# EAGLE design untitled (EAGLE 9.5.1)
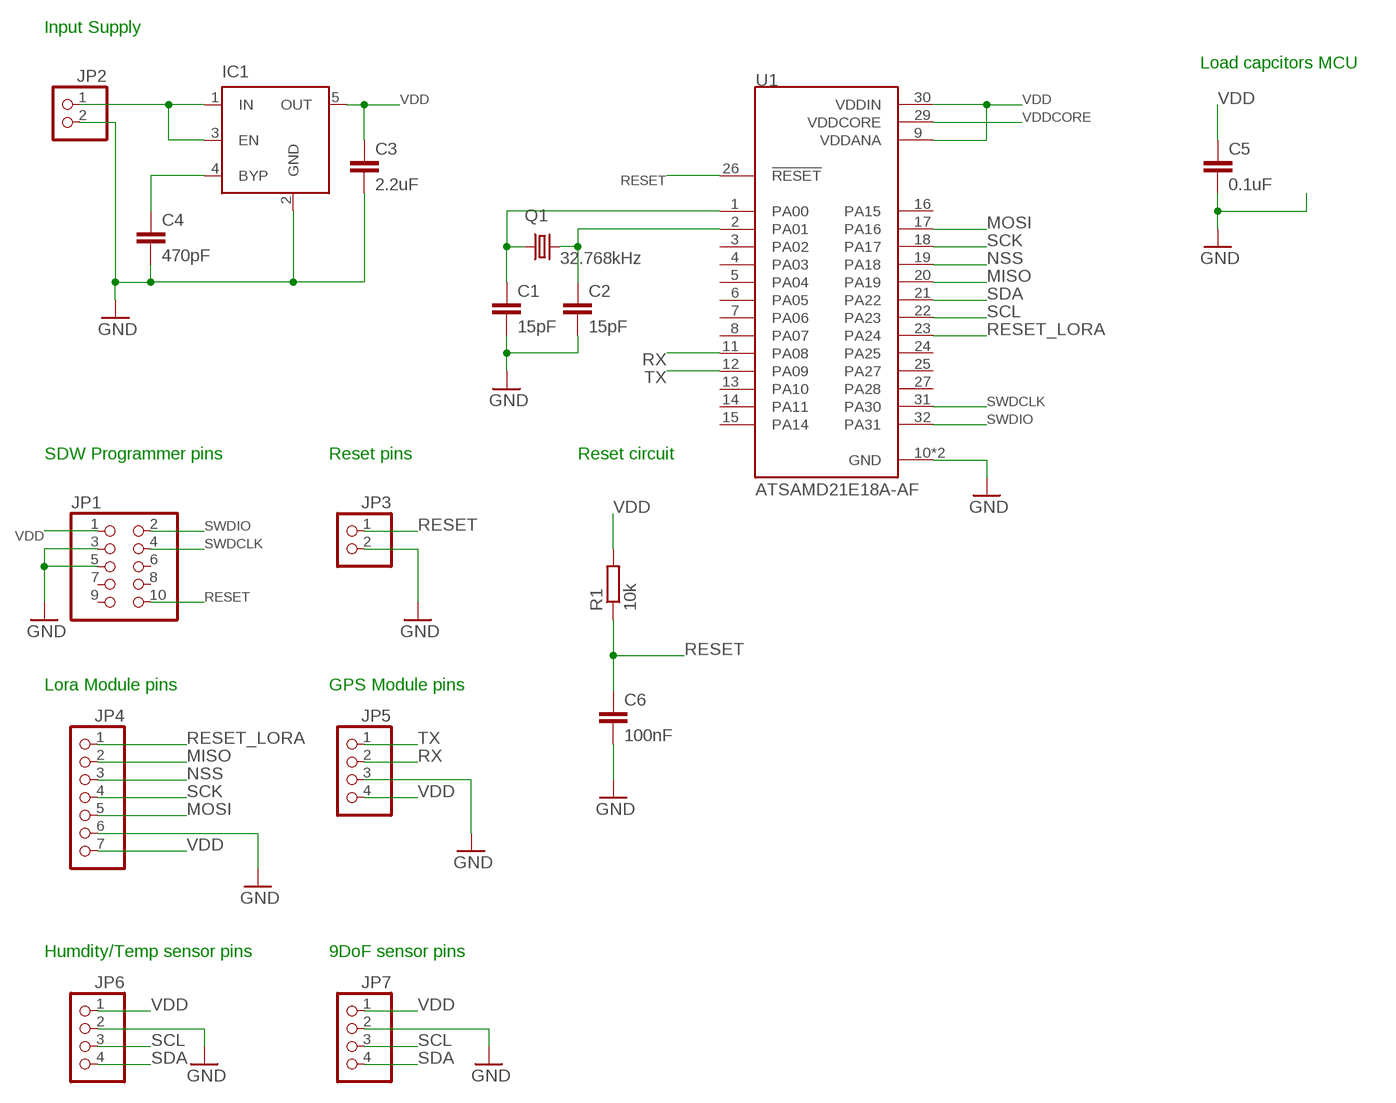
[diagram p0: schematic, sheet 1]

## Parts
C1  15pF  C-EUC0805  [C0805]
C2  15pF  C-EUC0805  [C0805]
C3  2.2uF  C-EUC0805  [C0805]
C4  470pF  C-EUC0805  [C0805]
C5  0.1uF  C-EUC0805  [C0805]
C6  100nF  C-EUC0805  [C0805]
IC1  MIC5219XX  [SOT23-5]
JP1  PINHD-2X5  [2X05]
JP2  PINHD-1X2  [1X02]
JP3  PINHD-1X2  [1X02]
JP4  PINHD-1X7  [1X07]
JP5  PINHD-1X4  [1X04]
JP6  PINHD-1X4  [1X04]
JP7  PINHD-1X4  [1X04]
Q1  32.768kHz  CRYSTALCTS406  [CTS406]
R1  10k  R-EU_R0805  [R0805]
U1  ATSAMD21E18A-AF  [QFP80P900X900X120-32N]

## Nets
BYP: C4.1 IC1.4(BYP)
GND: C1.2 C2.2 C3.2 C4.2 C5.2 C6.2 IC1.2(GND) JP1.3 JP1.5 JP2.2 JP3.2 JP4.6 JP5.3 JP6.2 JP7.2 U1.10(GND) U1.28(GND)
INPUT: IC1.1(IN) IC1.3(EN) JP2.1
MISO: JP4.2 U1.20(PA19)
MOSI: JP4.5 U1.17(PA16)
N$1: C1.1 Q1.1 U1.1(PA00)
N$2: C2.1 Q1.3 U1.2(PA01)
NSS: JP4.3 U1.19(PA18)
RESET: C6.1 JP1.10 JP3.1 R1.1 U1.26(!RESET)
RESET_LORA: JP4.1 U1.23(PA24)
RX: JP5.2 U1.11(PA08)
SCK: JP4.4 U1.18(PA17)
SCL: JP6.3 JP7.3 U1.22(PA23)
SDA: JP6.4 JP7.4 U1.21(PA22)
SWDCLK: JP1.4 U1.31(PA30)
SWDIO: JP1.2 U1.32(PA31)
TX: JP5.1 U1.12(PA09)
VDD: C3.1 C5.1 IC1.5(OUT) JP1.1 JP4.7 JP5.4 JP6.1 JP7.1 R1.2 U1.9(VDDANA) U1.30(VDDIN)
VDDCORE: U1.29(VDDCORE)
Unconnected: JP1.6 JP1.7 JP1.8 JP1.9 U1.3(PA02) U1.4(PA03) U1.5(PA04) U1.6(PA05) U1.7(PA06) U1.8(PA07) U1.13(PA10) U1.14(PA11) U1.15(PA14) U1.16(PA15) U1.24(PA25) U1.25(PA27) U1.27(PA28)

## Notes on the sheet
- Input Supply
- Load capcitors MCU
- SDW Programmer pins | Reset pins | Reset circuit
- Lora Module pins | GPS Module pins
- Humdity/Temp sensor pins | 9DoF sensor pins

## Library data of the parts
C1-C6 = rcl:C-EU: CAPACITOR, European symbol; SPICEPREFIX: C
IC1 = v-reg-micrel:MIC5219XX: VOLTAGE REGULATOR; OC_FARNELL: unknown; OC_NEWARK: unknown
JP1 = pinhead:PINHD-2X5: PIN HEADER
JP2 JP3 = pinhead:PINHD-1X2: PIN HEADER
JP4 = pinhead:PINHD-1X7: PIN HEADER
JP5-JP7 = pinhead:PINHD-1X4: PIN HEADER
Q1 = crystal:CRYSTAL: CRYSTAL; OC_FARNELL: unknown; OC_NEWARK: unknown
R1 = rcl:R-EU_: RESISTOR, European symbol; SPICEPREFIX: R
U1 = ATSAMD21E18A-AF:ATSAMD21E18A-AF: The SAM D21 is a series of low-power microcontrollers using the 32-bit ARM® Cortex® -M0+ processor, and ranging from 32- to 64-pins with up to 256KB Flash and 32KB of SRAM. The SAM D21 operate at a maximum frequency of 48MHz and reach 2.46 CoreMark® /MHz.; AVAILABILITY: Unavailable; DESCRIPTION: MCU 32-Bit SAM D21E ARM Cortex M0+ RISC 256KB Flash 3.3V 32-Pin TQFP Tray; MF: Microchip; MP: ATSAMD21E18A-AF; PACKAGE: TQFP-32 Microchip; PRICE: None

## Board
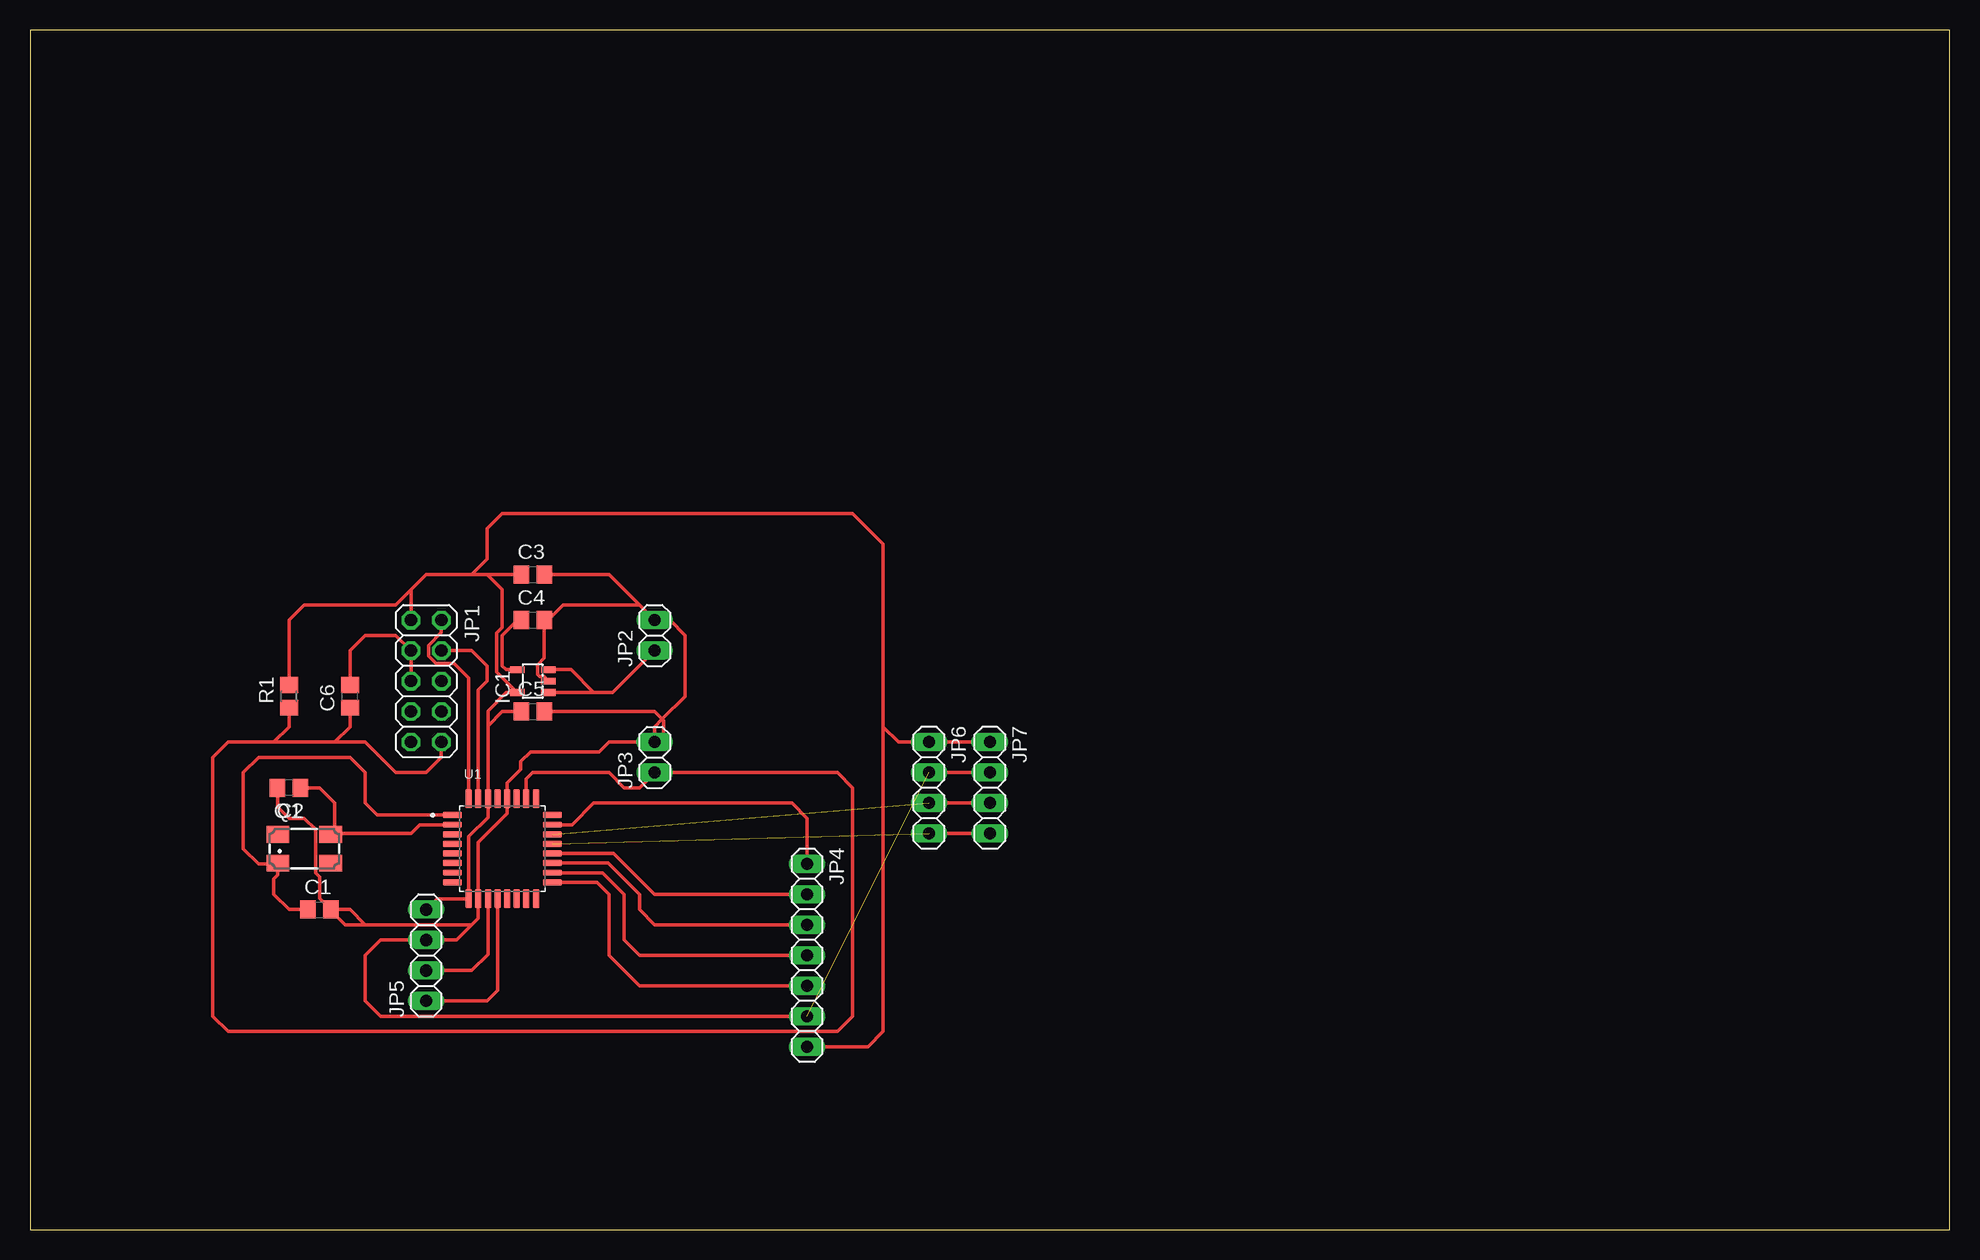
[diagram p1: board, top side]
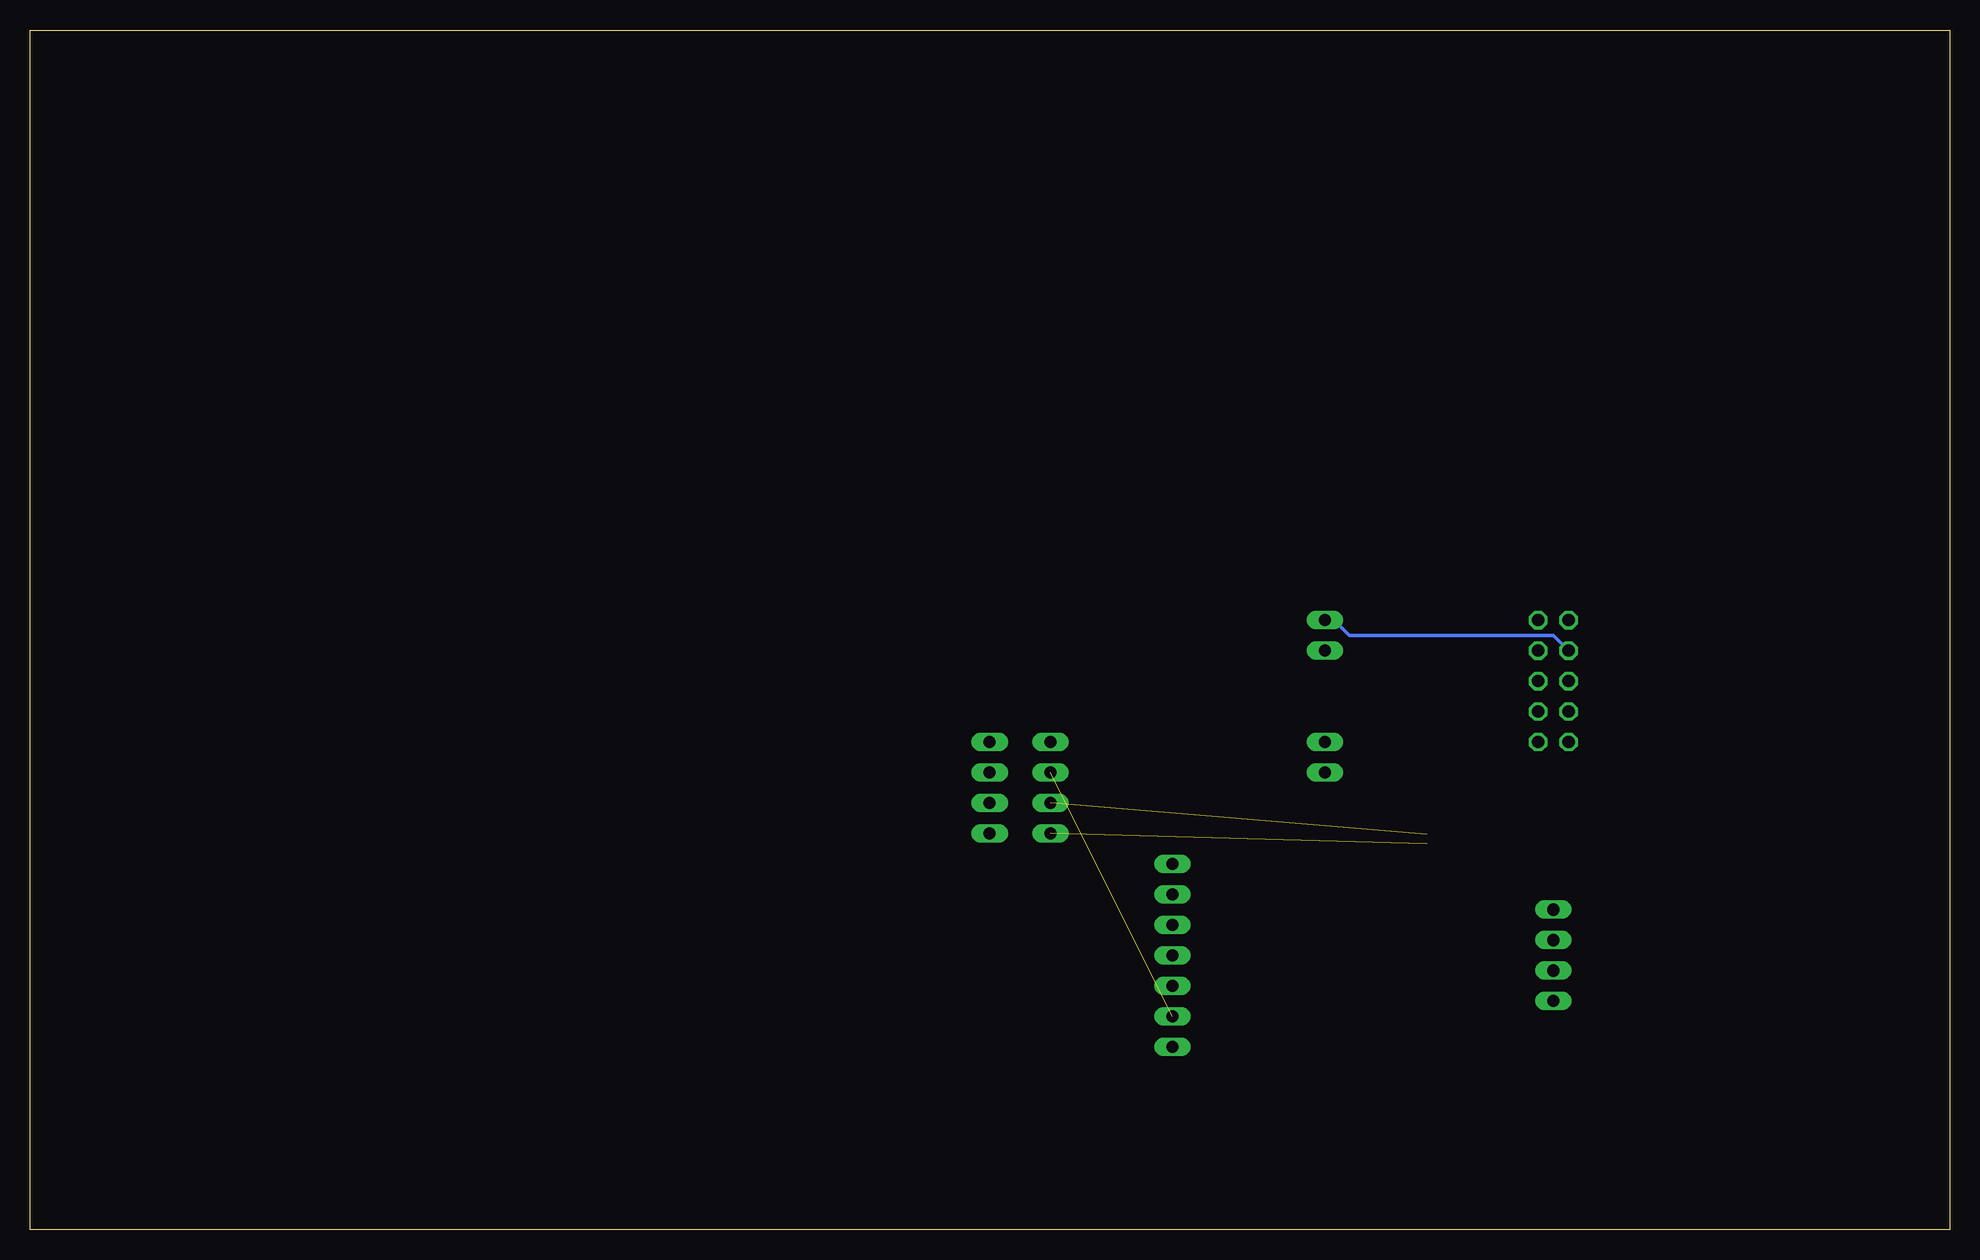
[diagram p2: board, bottom side, seen from below]

Size 160 x 100 mm. Coordinates in mm from the lower left corner, seen from the top.
Outline: 0,0 160,0 160,100 0,100 0,0
Copper layers (1*16): Top 0.035mm / dielectric 1.5mm / Bottom 0.035mm
Design rules "default": minimum track width 6mil, minimum drill 0.35mm, track to track 6mil, track to pad 6mil, pad to pad 6mil, via to via 6mil, smd to smd 6mil, copper to edge 40mil, drill to drill 6mil, minimum pad ring 10mil, minimum via ring 8mil, stop-mask expansion 4mil, vias tented up to drill 0mil, thermal gap 10mil

### Footprints (pad centres in the part's own frame; a part is rotated, then mirrored left to right if it is on the bottom)
C0805 = smd 1.3 x 1.5: 1 -0.95,0; 2 0.95,0
SOT23-5 = smd 0.55 x 1.2: 1 -0.95,-1.3; 2 0,-1.3; 3 0.95,-1.3; 4 0.95,1.3; 5 -0.95,1.3
2X05 = drill 1.016 octagon: 1 -5.08,-1.27; 2 -5.08,1.27; 3 -2.54,-1.27; 4 -2.54,1.27; 5 0,-1.27; 6 0,1.27; 7 2.54,-1.27; 8 2.54,1.27; 9 5.08,-1.27; 10 5.08,1.27
1X02 = drill 1.016 long: 1 -1.27,0; 2 1.27,0
1X07 = drill 1.016 long: 1 -7.62,0; 2 -5.08,0; 3 -2.54,0; 4 0,0; 5 2.54,0; 6 5.08,0; 7 7.62,0
1X04 = drill 1.016 long: 1 -3.81,0; 2 -1.27,0; 3 1.27,0; 4 3.81,0
CTS406 = smd 1.9 x 1.4: 1 -2.2,-1.2; 2 2.2,-1.2; 3 2.2,1.2; 4 -2.2,1.2
R0805 = smd 1.3 x 1.5: 1 -0.95,0; 2 0.95,0
QFP80P900X900X120-32N = smd 1.6 x 0.55: 1 -4.18,2.8; 2 -4.18,2; 3 -4.18,1.2; 4 -4.18,0.4; 5 -4.18,-0.4; 6 -4.18,-1.2; 7 -4.18,-2; 8 -4.18,-2.8; 17 4.18,-2.8; 18 4.18,-2; 19 4.18,-1.2; 20 4.18,-0.4; 21 4.18,0.4; 22 4.18,1.2; 23 4.18,2; 24 4.18,2.8 | smd 0.55 x 1.6: 9 -2.8,-4.18; 10 -2,-4.18; 11 -1.2,-4.18; 12 -0.4,-4.18; 13 0.4,-4.18; 14 1.2,-4.18; 15 2,-4.18; 16 2.8,-4.18; 25 2.8,4.18; 26 2,4.18; 27 1.2,4.18; 28 0.4,4.18; 29 -0.4,4.18; 30 -1.2,4.18; 31 -2,4.18; 32 -2.8,4.18

### Placement (x,y rotation side)
C1  24.13,26.67 0 top
C2  21.59,36.83 180 top
C3  41.91,54.61 0 top
C4  41.91,50.8 0 top
C5  41.91,43.18 0 top
C6  26.67,44.45 90 top
IC1  41.91,45.72 90 top
JP1  33.02,45.72 270 top
JP2  52.07,49.53 90 top
JP3  52.07,39.37 90 top
JP4  64.77,22.86 270 top
JP5  33.02,22.86 90 top
JP6  74.93,36.83 270 top
JP7  80.01,36.83 270 top
Q1  22.86,31.75 0 top
R1  21.59,44.45 90 top
U1  39.37,31.75 0 top

### Tracks (layer width: path | path; a pad name or v marks a point on that pad's centre or on a via)
BYP
  Top 0.305: IC1.4 39.69,46.67 39.37,46.99 39.37,49.53 40.64,50.8 C4.1
GND  (1 unrouted)
  Top 0.305: C2.2 20.64,35.24 21.59,34.29 22.86,34.29 23.8,33.34 23.8,29.72 24.13,29.4 24.13,27.62 C1.2 | 36.83,25.4 37.37,25.94 U1.10 37.37,32.29 39.77,34.69 U1.28 39.77,37.23 40.91,38.37 40.91,39.02 41.72,39.83 47.45,39.83 48.26,40.64 JP3.2 | 36.83,25.4 27.94,25.4 | 27.94,25.4 26.67,26.67 C1.2 | IC1.2 42.84,46.09 42.48,46.09 42.3,46.27 42.3,47.07 42.86,47.63 C4.2 43.18,50.8 44.45,52.07 50.8,52.07 | 50.8,52.07 JP2.2 53.34,50.8 54.61,49.53 54.61,44.45 52.7,42.55 | C3.2 48.26,54.61 50.8,52.07 | JP3.2 52.07,41.91 52.7,42.55 | 36.83,25.4 35.56,24.13 JP5.3 29.21,24.13 27.94,22.86 27.94,19.05 29.21,17.78 JP4.6 | C5.2 52.07,43.18 52.7,42.55 | JP1.5 JP1.3 30.48,49.53 27.94,49.53 26.67,48.26 C6.2 | 52.7,42.55 52.83,42.42 52.83,40.64 JP3.2 | 27.94,25.4 26.25,25.4 25.08,26.57 C1.2 | JP7.2 JP6.2
  Bottom 0.305: JP1.3 33.02,49.53 50.04,49.53 51.31,50.8 JP2.2
INPUT
  Top 0.305: IC1.1 46.99,44.77 | 46.99,44.77 48.58,44.77 JP2.1 | IC1.3 45.09,46.67 46.99,44.77
MISO
  Top 0.305: U1.20 48.66,31.35 52.07,27.94 JP4.2
MOSI
  Top 0.305: U1.17 47.25,28.95 48.26,27.94 48.26,22.86 50.8,20.32 JP4.5
N$1
  Top 0.305: C1.1 21.59,26.67 20.32,27.94 20.32,29.21 20.66,29.55 Q1.1 | 20.32,30.21 Q1.1 | U1.1 28.95,34.55 27.94,35.56 27.94,38.1 26.67,39.37 19.05,39.37 17.78,38.1 17.78,31.75 19.05,30.48 20.59,30.48 Q1.1
N$2
  Top 0.305: C2.1 24.13,36.83 25.4,35.56 25.4,33.29 Q1.3 25.13,33.02 31.75,33.02 32.48,33.75 U1.2
NSS
  Top 0.305: U1.19 48.19,30.55 50.8,27.94 50.8,26.67 52.07,25.4 JP4.3
RESET
  Top 0.305: 20.32,40.64 16.51,40.64 15.24,39.37 15.24,17.78 16.51,16.51 67.31,16.51 68.58,17.78 68.58,36.83 67.31,38.1 JP3.1 50.8,36.83 49.53,36.83 48.26,38.1 41.91,38.1 41.37,37.56 U1.26 | 20.32,40.64 25.4,40.64 | 25.4,40.64 27.94,40.64 30.48,38.1 33.02,38.1 34.29,39.37 JP1.10 | C6.1 26.67,41.91 25.4,40.64 | R1.1 21.59,41.91 20.32,40.64
RESET_LORA
  Top 0.305: 63.5,30.48 JP4.1 64.77,34.29 63.5,35.56 46.99,35.56 45.18,33.75 U1.23
RX
  Top 0.305: U1.11 38.17,22.93 36.83,21.59 JP5.2
SCK
  Top 0.305: JP4.4 50.8,22.86 49.53,24.13 49.53,27.94 47.72,29.75 U1.18
SCL  (1 unrouted)
  Top 0.305: JP6.3 JP7.3
SDA  (1 unrouted)
  Top 0.305: JP7.4 JP6.4
SWDCLK
  Top 0.305: JP1.4 36.83,48.26 38.1,46.99 38.1,45.72 37.37,44.99 U1.31
SWDIO
  Top 0.305: JP1.2 34.29,49.77 33.22,48.7 33.22,47.82 33.85,47.19 35.36,47.19 36.57,45.98 U1.32
TX
  Top 0.305: U1.12 38.97,19.92 38.1,19.05 JP5.1
VDD
  Top 0.305: 38.17,41.98 U1.30 38.17,34.36 36.57,32.76 U1.9 33.92,27.57 JP5.4 | 38.17,41.98 38.17,43.25 39.69,44.77 IC1.5 38.91,46.47 38.91,49.72 39.37,50.18 39.37,53.34 38.1,54.61 | C3.1 38.1,54.61 | 38.1,54.61 36.83,54.61 | 36.83,54.61 33.02,54.61 31.75,53.34 | 31.75,53.34 JP1.1 | C5.1 39.37,43.18 38.17,41.98 | 31.75,53.34 30.48,52.07 22.86,52.07 21.59,50.8 R1.2 | JP4.7 69.85,15.24 71.12,16.51 71.12,41.91 | 71.12,41.91 71.12,57.15 68.58,59.69 39.37,59.69 38.1,58.42 38.1,55.88 36.83,54.61 | JP7.1 JP6.1 72.39,40.64 71.12,41.91